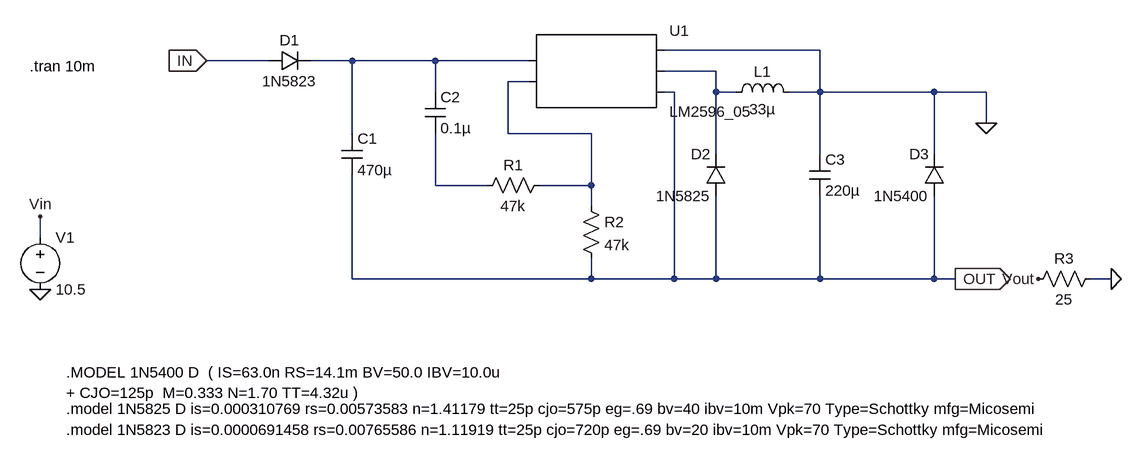
[diagram p0: schematic Conmutado-5.asc]
Conmutado-5.asc, the LTspice schematic file:
Version 4
SHEET 1 1088 680
WIRE 384 -80 144 -80
WIRE -464 -64 -560 -64
WIRE -336 -64 -400 -64
WIRE -208 -64 -336 -64
WIRE -64 -64 -208 -64
WIRE 224 -48 144 -48
WIRE -64 -32 -96 -32
WIRE -208 -16 -208 -64
WIRE 160 -16 144 -16
WIRE 224 -16 224 -48
WIRE 256 -16 224 -16
WIRE 384 -16 384 -80
WIRE 384 -16 336 -16
WIRE 560 -16 384 -16
WIRE 640 -16 560 -16
WIRE 640 32 640 -16
WIRE -336 48 -336 -64
WIRE -96 48 -96 -32
WIRE 32 48 -96 48
WIRE 224 80 224 -16
WIRE 384 80 384 -16
WIRE 560 80 560 -16
WIRE -208 128 -208 48
WIRE -128 128 -208 128
WIRE 32 128 32 48
WIRE 32 128 -48 128
WIRE 32 160 32 128
WIRE -816 208 -816 176
WIRE -336 272 -336 112
WIRE 32 272 32 240
WIRE 32 272 -336 272
WIRE 160 272 160 -16
WIRE 160 272 32 272
WIRE 224 272 224 144
WIRE 224 272 160 272
WIRE 384 272 384 144
WIRE 384 272 224 272
WIRE 560 272 560 144
WIRE 560 272 384 272
WIRE 592 272 560 272
WIRE 832 272 800 272
FLAG 640 32 0
FLAG 832 272 0
FLAG 720 272 Vout
FLAG -816 288 0
FLAG -816 176 Vin
FLAG -560 -64 IN
IOPIN -560 -64 In
FLAG 592 272 OUT
IOPIN 592 272 Out
SYMBOL diode -464 -48 R270
WINDOW 0 32 32 VTop 2
WINDOW 3 0 32 VBottom 2
SYMATTR InstName D1
SYMATTR Value 1N5823
SYMBOL cap -352 48 R0
SYMATTR InstName C1
SYMATTR Value 470µ
SYMBOL cap -224 -16 R0
SYMATTR InstName C2
SYMATTR Value 0.1µ
SYMBOL res -32 112 R90
WINDOW 0 0 56 VBottom 2
WINDOW 3 32 56 VTop 2
SYMATTR InstName R1
SYMATTR Value 47k
SYMBOL res 16 144 R0
SYMATTR InstName R2
SYMATTR Value 47k
SYMBOL diode 240 144 R180
WINDOW 0 24 64 Left 2
WINDOW 3 24 0 Left 2
SYMATTR InstName D2
SYMATTR Value 1N5825
SYMBOL ind 240 0 R270
WINDOW 0 32 56 VTop 2
WINDOW 3 5 56 VBottom 2
SYMATTR InstName L1
SYMATTR Value 33µ
SYMBOL cap 368 80 R0
SYMATTR InstName C3
SYMATTR Value 220µ
SYMBOL diode 576 144 R180
WINDOW 0 24 64 Left 2
WINDOW 3 24 0 Left 2
SYMATTR InstName D3
SYMATTR Value 1N5400
SYMBOL AutoGenerated/LM2596_05 32 -48 R0
SYMATTR InstName U1
SYMBOL res 816 256 R90
WINDOW 0 0 56 VBottom 2
WINDOW 3 32 56 VTop 2
SYMATTR InstName R3
SYMATTR Value 25
SYMBOL voltage -816 192 R0
SYMATTR InstName V1
SYMATTR Value 10.5
TEXT -776 472 Left 2 !.model 1N5825 D is=0.000310769 rs=0.00573583 n=1.41179 tt=25p cjo=575p eg=.69 bv=40 ibv=10m Vpk=70 Type=Schottky mfg=Micosemi
TEXT -776 416 Left 2 !.MODEL 1N5400 D  ( IS=63.0n RS=14.1m BV=50.0 IBV=10.0u \n+ CJO=125p  M=0.333 N=1.70 TT=4.32u )
TEXT -776 504 Left 2 !.model 1N5823 D is=0.0000691458 rs=0.00765586 n=1.11919 tt=25p cjo=720p eg=.69 bv=20 ibv=10m Vpk=70 Type=Schottky mfg=Micosemi
TEXT -832 -56 Left 2 !.tran 10m

The netlist it stands for:
* Conmutado-5.asc
D1 IN N001 1N5823
C1 N001 OUT 470µ
C2 N001 N004 0.1µ
R1 N003 N004 47k
R2 N003 OUT 47k
D2 OUT N002 1N5825
L1 N002 0 33µ
C3 0 OUT 220µ
D3 OUT 0 1N5400
* U1: LM2596_05 (symbol AutoGenerated/LM2596_05 not available, pins judged from their places): pin1=N001 pin2=N003 pin3=0 pin4=N002 pin5=OUT
R3 0 Vout 25
V1 Vin 0 10.5
.model D D
.lib standard.dio
.model 1N5825 D is=0.000310769 rs=0.00573583 n=1.41179 tt=25p cjo=575p eg=.69 bv=40 ibv=10m Vpk=70 Type=Schottky mfg=Micosemi
.MODEL 1N5400 D  ( IS=63.0n RS=14.1m BV=50.0 IBV=10.0u
+ CJO=125p  M=0.333 N=1.70 TT=4.32u )
.model 1N5823 D is=0.0000691458 rs=0.00765586 n=1.11919 tt=25p cjo=720p eg=.69 bv=20 ibv=10m Vpk=70 Type=Schottky mfg=Micosemi
.tran 10m
.backanno
.end